# Altium schematic sheet AD.SchDoc
size A2; Organization: Protel International P/L; Address1: L3, 12a Rodborough Rd; Address2: Frenchs Forest; Address3: NSW; Address4: Australia 2086
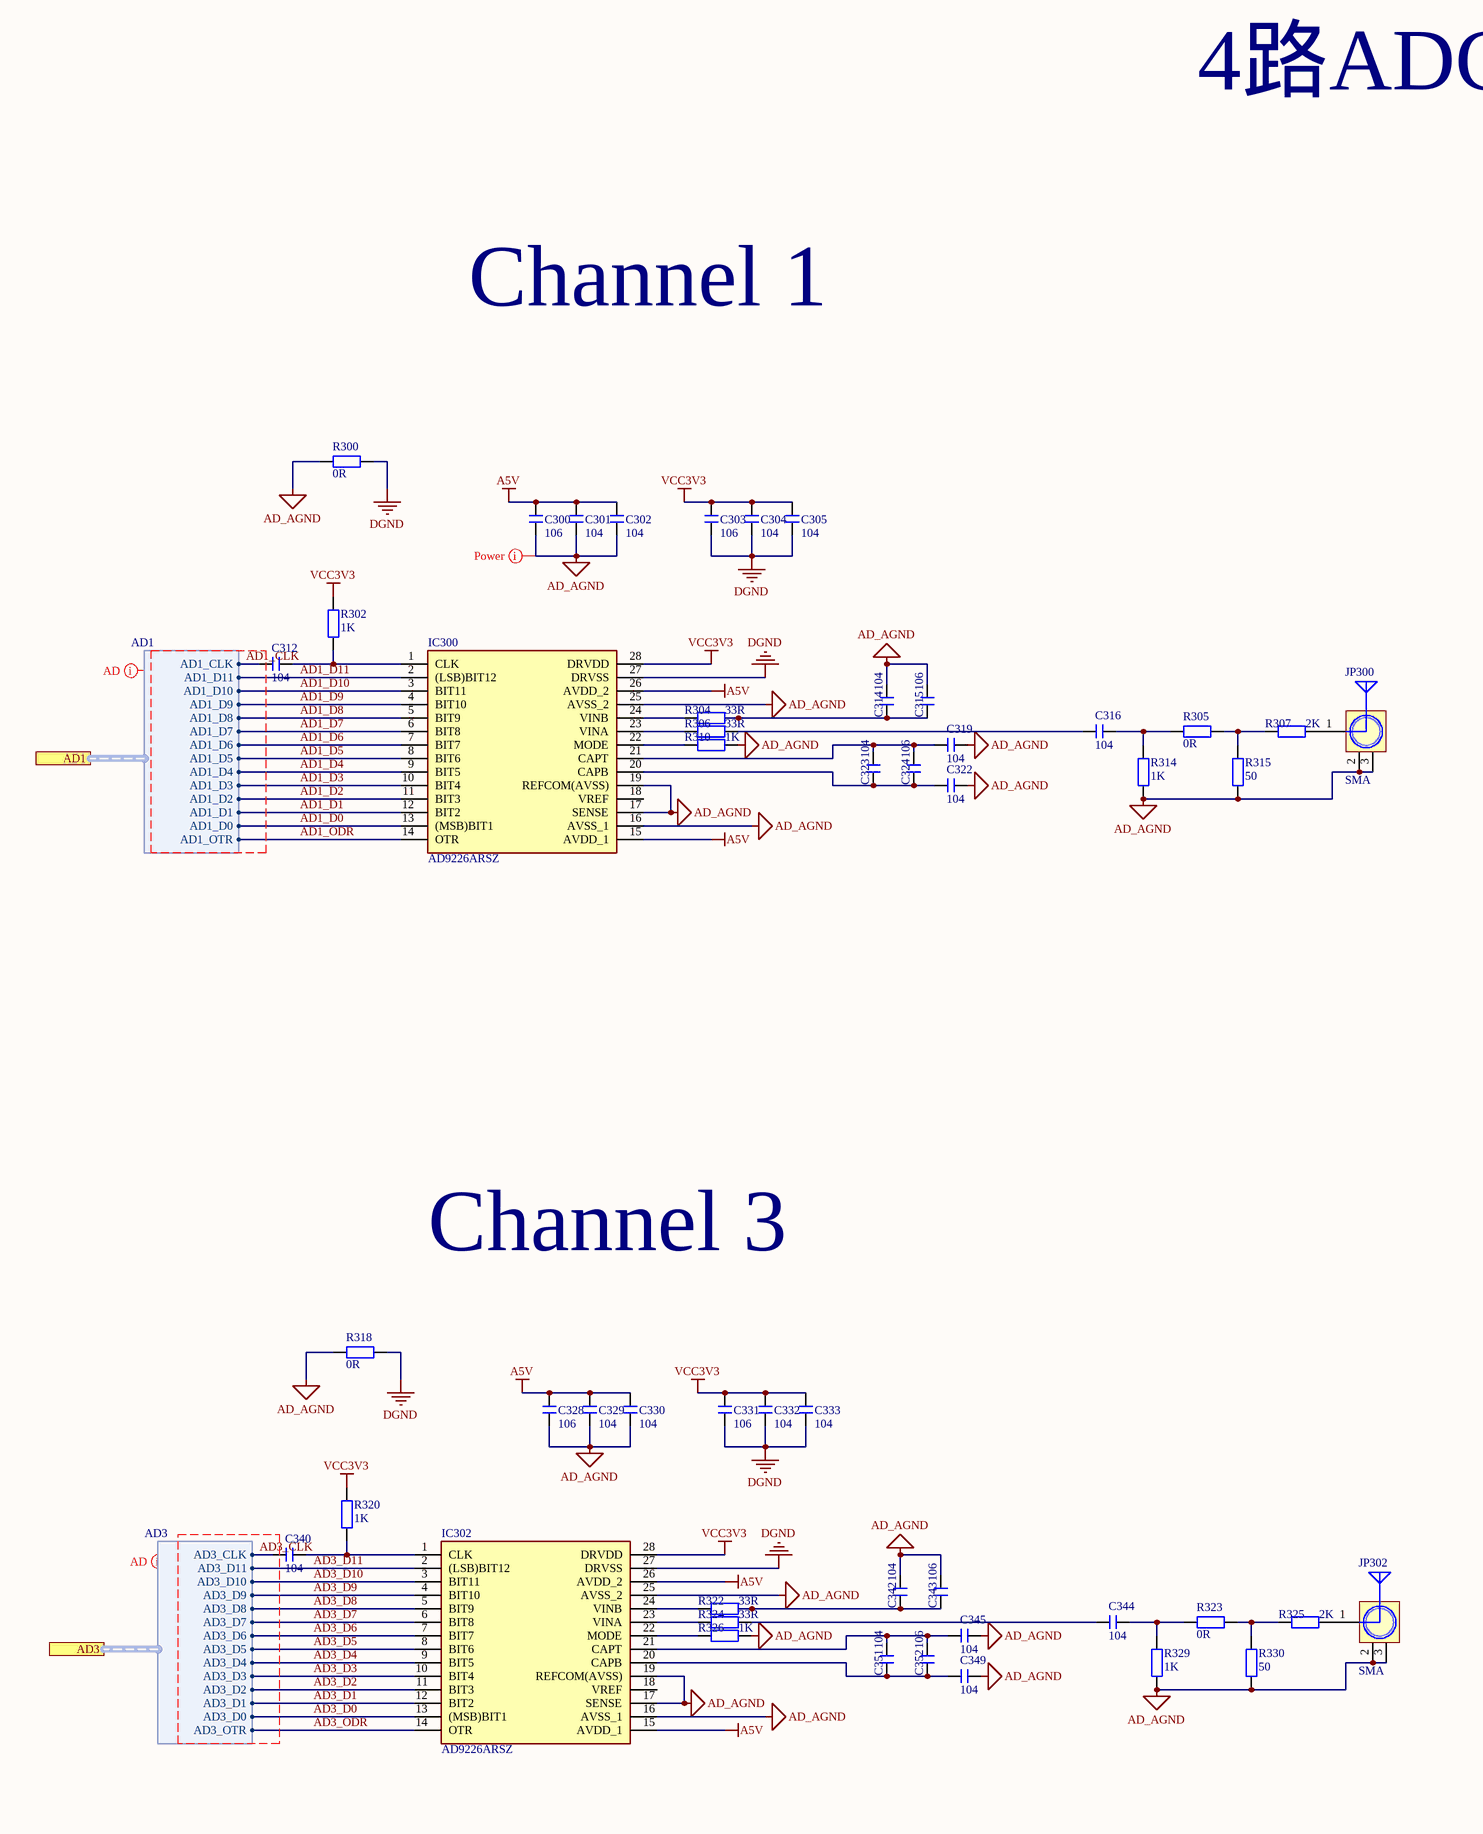
[diagram p0: AD.SchDoc, left]
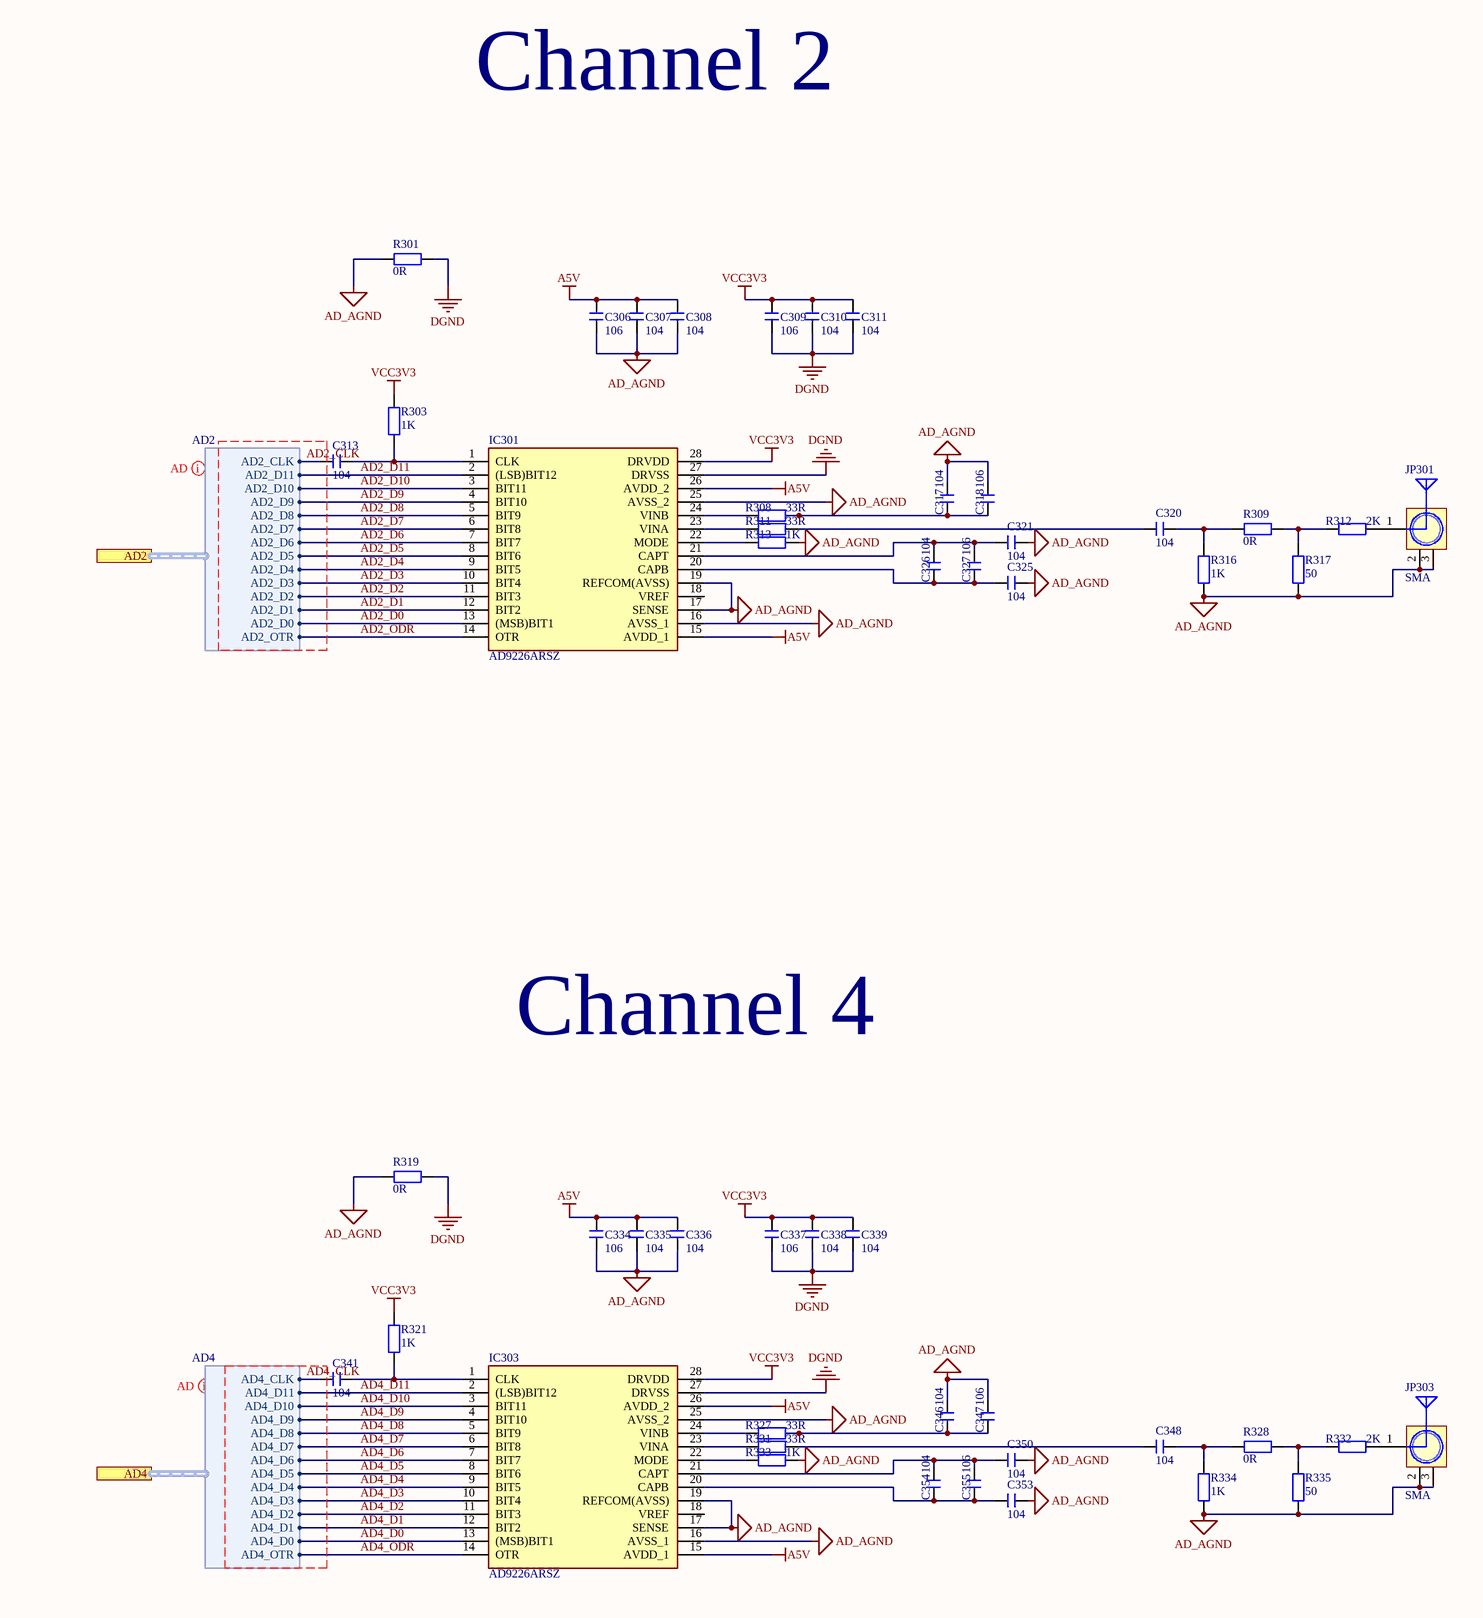
[diagram p1: AD.SchDoc, right]

## Parts
C300  106  [C 0402_M]
C301  104  [C 0402_M]
C302  104  [C 0402_M]
C303  106  [C 0402_M]
C304  104  [C 0402_M]
C305  104  [C 0402_M]
C306  106  [C 0402_M]
C307  104  [C 0402_M]
C308  104  [C 0402_M]
C309  106  [C 0402_M]
C310  104  [C 0402_M]
C311  104  [C 0402_M]
C312  104  [C 0402_M]
C313  104  [C 0402_M]
C314  104  [C 0402_M]
C315  106  [C 0402_M]
C316  104  [C 0402_M]
C317  104  [C 0402_M]
C318  106  [C 0402_M]
C319  104  [C 0402_M]
C320  104  [C 0402_M]
C321  104  [C 0402_M]
C322  104  [C 0402_M]
C323  104  [C 0402_M]
C324  106  [C 0402_M]
C325  104  [C 0402_M]
C326  104  [C 0402_M]
C327  106  [C 0402_M]
C328  106  [C 0402_M]
C329  104  [C 0402_M]
C330  104  [C 0402_M]
C331  106  [C 0402_M]
C332  104  [C 0402_M]
C333  104  [C 0402_M]
C334  106  [C 0402_M]
C335  104  [C 0402_M]
C336  104  [C 0402_M]
C337  106  [C 0402_M]
C338  104  [C 0402_M]
C339  104  [C 0402_M]
C340  104  [C 0402_M]
C341  104  [C 0402_M]
C342  104  [C 0402_M]
C343  106  [C 0402_M]
C344  104  [C 0402_M]
C345  104  [C 0402_M]
C346  104  [C 0402_M]
C347  106  [C 0402_M]
C348  104  [C 0402_M]
C349  104  [C 0402_M]
C350  104  [C 0402_M]
C351  104  [C 0402_M]
C352  106  [C 0402_M]
C353  104  [C 0402_M]
C354  104  [C 0402_M]
C355  106  [C 0402_M]
IC300  AD9226ARSZ  [SOP65P777X198-28N]
IC301  AD9226ARSZ  [SOP65P777X198-28N]
IC302  AD9226ARSZ  [SOP65P777X198-28N]
IC303  AD9226ARSZ  [SOP65P777X198-28N]
JP300  SMA  [SMA_FR]
JP301  SMA  [SMA_FR]
JP302  SMA  [SMA_FR]
JP303  SMA  [SMA_FR]
R300  0R  [R 0402_M]
R301  0R  [R 0402_M]
R302  1K  [R 0402_M]
R303  1K  [R 0402_M]
R304  33R  [R 0402_M]
R305  0R  [R 0402_M]
R306  33R  [R 0402_M]
R307  2K  [R 0402_M]
R308  33R  [R 0402_M]
R309  0R  [R 0402_M]
R310  1K  [R 0402_M]
R311  33R  [R 0402_M]
R312  2K  [R 0402_M]
R313  1K  [R 0402_M]
R314  1K  [R 0402_M]
R315  50  [R 0402_M]
R316  1K  [R 0402_M]
R317  50  [R 0402_M]
R318  0R  [R 0402_M]
R319  0R  [R 0402_M]
R320  1K  [R 0402_M]
R321  1K  [R 0402_M]
R322  33R  [R 0402_M]
R323  0R  [R 0402_M]
R324  33R  [R 0402_M]
R325  2K  [R 0402_M]
R326  1K  [R 0402_M]
R327  33R  [R 0402_M]
R328  0R  [R 0402_M]
R329  1K  [R 0402_M]
R330  50  [R 0402_M]
R331  33R  [R 0402_M]
R332  2K  [R 0402_M]
R333  1K  [R 0402_M]
R334  1K  [R 0402_M]
R335  50  [R 0402_M]

## Ports
AD1 (harness AD1), AD2 (harness AD2), AD3 (harness AD3), AD4 (harness AD4)

## Harnesses
AD1: AD1_CLK, AD1_D11, AD1_D10, AD1_D9, AD1_D8, AD1_D7, AD1_D6, AD1_D5, AD1_D4, AD1_D3, AD1_D2, AD1_D1, AD1_D0, AD1_OTR
AD2: AD2_CLK, AD2_D11, AD2_D10, AD2_D9, AD2_D8, AD2_D7, AD2_D6, AD2_D5, AD2_D4, AD2_D3, AD2_D2, AD2_D1, AD2_D0, AD2_OTR
AD3: AD3_CLK, AD3_D11, AD3_D10, AD3_D9, AD3_D8, AD3_D7, AD3_D6, AD3_D5, AD3_D4, AD3_D3, AD3_D2, AD3_D1, AD3_D0, AD3_OTR
AD4: AD4_CLK, AD4_D11, AD4_D10, AD4_D9, AD4_D8, AD4_D7, AD4_D6, AD4_D5, AD4_D4, AD4_D3, AD4_D2, AD4_D1, AD4_D0, AD4_OTR

## Nets
A5V: C300.1 C301.1 C302.1 C306.1 C307.1 C308.1 C328.1 C329.1 C330.1 C334.1 C335.1 C336.1 IC300.15(AVDD_1) IC300.26(AVDD_2) IC301.15(AVDD_1) IC301.26(AVDD_2) IC302.15(AVDD_1) IC302.26(AVDD_2) IC303.15(AVDD_1) IC303.26(AVDD_2)
AD_AGND: C300.2 C301.2 C302.2 C306.2 C307.2 C308.2 C314.2 C315.2 C317.2 C318.2 C319.1 C321.1 C322.1 C325.1 C328.2 C329.2 C330.2 C334.2 C335.2 C336.2 C342.2 C343.2 C345.1 C346.2 C347.2 C349.1 C350.1 C353.1 IC300.16(AVSS_1) IC300.17(SENSE) IC300.19(REFCOM(AVSS)) IC300.25(AVSS_2) IC301.16(AVSS_1) IC301.17(SENSE) IC301.19(REFCOM(AVSS)) IC301.25(AVSS_2) IC302.16(AVSS_1) IC302.17(SENSE) IC302.19(REFCOM(AVSS)) IC302.25(AVSS_2) IC303.16(AVSS_1) IC303.17(SENSE) IC303.19(REFCOM(AVSS)) IC303.25(AVSS_2) JP300.2(GND) JP300.3(GND) JP301.2(GND) JP301.3(GND) JP302.2(GND) JP302.3(GND) JP303.2(GND) JP303.3(GND) R300.1 R301.1 R310.2 R313.2 R314.1 R315.1 R316.1 R317.1 R318.1 R319.1 R326.2 R329.1 R330.1 R333.2 R334.1 R335.1
DGND: C303.2 C304.2 C305.2 C309.2 C310.2 C311.2 C331.2 C332.2 C333.2 C337.2 C338.2 C339.2 IC300.27(DRVSS) IC301.27(DRVSS) IC302.27(DRVSS) IC303.27(DRVSS) R300.2 R301.2 R318.2 R319.2
VCC3V3: C303.1 C304.1 C305.1 C309.1 C310.1 C311.1 C331.1 C332.1 C333.1 C337.1 C338.1 C339.1 IC300.28(DRVDD) IC301.28(DRVDD) IC302.28(DRVDD) IC303.28(DRVDD) R302.1 R303.1 R320.1 R321.1
AD1_CLK: C312.2 ; port AD1.AD1_CLK
AD1_D0: IC300.13((MSB)BIT1) ; port AD1.AD1_D0
AD1_D1: IC300.12(BIT2) ; port AD1.AD1_D1
AD1_D2: IC300.11(BIT3) ; port AD1.AD1_D2
AD1_D3: IC300.10(BIT4) ; port AD1.AD1_D3
AD1_D4: IC300.9(BIT5) ; port AD1.AD1_D4
AD1_D5: IC300.8(BIT6) ; port AD1.AD1_D5
AD1_D6: IC300.7(BIT7) ; port AD1.AD1_D6
AD1_D7: IC300.6(BIT8) ; port AD1.AD1_D7
AD1_D8: IC300.5(BIT9) ; port AD1.AD1_D8
AD1_D9: IC300.4(BIT10) ; port AD1.AD1_D9
AD1_D10: IC300.3(BIT11) ; port AD1.AD1_D10
AD1_D11: IC300.2((LSB)BIT12) ; port AD1.AD1_D11
AD1_ODR: IC300.14(OTR) ; port AD1.AD1_OTR
AD2_CLK: C313.2 ; port AD2.AD2_CLK
AD2_D0: IC301.13((MSB)BIT1) ; port AD2.AD2_D0
AD2_D1: IC301.12(BIT2) ; port AD2.AD2_D1
AD2_D2: IC301.11(BIT3) ; port AD2.AD2_D2
AD2_D3: IC301.10(BIT4) ; port AD2.AD2_D3
AD2_D4: IC301.9(BIT5) ; port AD2.AD2_D4
AD2_D5: IC301.8(BIT6) ; port AD2.AD2_D5
AD2_D6: IC301.7(BIT7) ; port AD2.AD2_D6
AD2_D7: IC301.6(BIT8) ; port AD2.AD2_D7
AD2_D8: IC301.5(BIT9) ; port AD2.AD2_D8
AD2_D9: IC301.4(BIT10) ; port AD2.AD2_D9
AD2_D10: IC301.3(BIT11) ; port AD2.AD2_D10
AD2_D11: IC301.2((LSB)BIT12) ; port AD2.AD2_D11
AD2_ODR: IC301.14(OTR) ; port AD2.AD2_OTR
AD3_CLK: C340.2 ; port AD3.AD3_CLK
AD3_D0: IC302.13((MSB)BIT1) ; port AD3.AD3_D0
AD3_D1: IC302.12(BIT2) ; port AD3.AD3_D1
AD3_D2: IC302.11(BIT3) ; port AD3.AD3_D2
AD3_D3: IC302.10(BIT4) ; port AD3.AD3_D3
AD3_D4: IC302.9(BIT5) ; port AD3.AD3_D4
AD3_D5: IC302.8(BIT6) ; port AD3.AD3_D5
AD3_D6: IC302.7(BIT7) ; port AD3.AD3_D6
AD3_D7: IC302.6(BIT8) ; port AD3.AD3_D7
AD3_D8: IC302.5(BIT9) ; port AD3.AD3_D8
AD3_D9: IC302.4(BIT10) ; port AD3.AD3_D9
AD3_D10: IC302.3(BIT11) ; port AD3.AD3_D10
AD3_D11: IC302.2((LSB)BIT12) ; port AD3.AD3_D11
AD3_ODR: IC302.14(OTR) ; port AD3.AD3_OTR
AD4_CLK: C341.2 ; port AD4.AD4_CLK
AD4_D0: IC303.13((MSB)BIT1) ; port AD4.AD4_D0
AD4_D1: IC303.12(BIT2) ; port AD4.AD4_D1
AD4_D2: IC303.11(BIT3) ; port AD4.AD4_D2
AD4_D3: IC303.10(BIT4) ; port AD4.AD4_D3
AD4_D4: IC303.9(BIT5) ; port AD4.AD4_D4
AD4_D5: IC303.8(BIT6) ; port AD4.AD4_D5
AD4_D6: IC303.7(BIT7) ; port AD4.AD4_D6
AD4_D7: IC303.6(BIT8) ; port AD4.AD4_D7
AD4_D8: IC303.5(BIT9) ; port AD4.AD4_D8
AD4_D9: IC303.4(BIT10) ; port AD4.AD4_D9
AD4_D10: IC303.3(BIT11) ; port AD4.AD4_D10
AD4_D11: IC303.2((LSB)BIT12) ; port AD4.AD4_D11
AD4_ODR: IC303.14(OTR) ; port AD4.AD4_OTR
NetC312_1: C312.1 IC300.1(CLK) R302.2
NetC313_1: C313.1 IC301.1(CLK) R303.2
NetC314_1: C314.1 C315.1 R304.2
NetC316_1: C316.1 R305.2 R314.2
NetC316_2: C316.2 R306.2
NetC317_1: C317.1 C318.1 R308.2
NetC319_2: C319.2 C323.2 C324.2 IC300.21(CAPT)
NetC320_1: C320.1 R309.2 R316.2
NetC320_2: C320.2 R311.2
NetC321_2: C321.2 C326.2 C327.2 IC301.21(CAPT)
NetC322_2: C322.2 C323.1 C324.1 IC300.20(CAPB)
NetC325_2: C325.2 C326.1 C327.1 IC301.20(CAPB)
NetC340_1: C340.1 IC302.1(CLK) R320.2
NetC341_1: C341.1 IC303.1(CLK) R321.2
NetC342_1: C342.1 C343.1 R322.2
NetC344_1: C344.1 R323.2 R329.2
NetC344_2: C344.2 R324.2
NetC345_2: C345.2 C351.2 C352.2 IC302.21(CAPT)
NetC346_1: C346.1 C347.1 R327.2
NetC348_1: C348.1 R328.2 R334.2
NetC348_2: C348.2 R331.2
NetC349_2: C349.2 C351.1 C352.1 IC302.20(CAPB)
NetC350_2: C350.2 C354.2 C355.2 IC303.21(CAPT)
NetC353_2: C353.2 C354.1 C355.1 IC303.20(CAPB)
NetIC300_22: IC300.22(MODE) R310.1
NetIC300_23: IC300.23(VINA) R306.1
NetIC300_24: IC300.24(VINB) R304.1
NetIC301_22: IC301.22(MODE) R313.1
NetIC301_23: IC301.23(VINA) R311.1
NetIC301_24: IC301.24(VINB) R308.1
NetIC302_22: IC302.22(MODE) R326.1
NetIC302_23: IC302.23(VINA) R324.1
NetIC302_24: IC302.24(VINB) R322.1
NetIC303_22: IC303.22(MODE) R333.1
NetIC303_23: IC303.23(VINA) R331.1
NetIC303_24: IC303.24(VINB) R327.1
NetJP300_1: JP300.1(ANT) R307.2
NetJP301_1: JP301.1(ANT) R312.2
NetJP302_1: JP302.1(ANT) R325.2
NetJP303_1: JP303.1(ANT) R332.2
NetR305_1: R305.1 R307.1 R315.2
NetR309_1: R309.1 R312.1 R317.2
NetR323_1: R323.1 R325.1 R330.2
NetR328_1: R328.1 R332.1 R335.2

Not connected (* = marked no-connect by the designer): IC300 18(VREF); IC301 18(VREF); IC302 18(VREF); IC303 18(VREF)

## Layout directives
net class Power: AD_AGND
net class AD1; rule Matched Net Lengths [Tolerance = 100mil]: AD1_CLK
net class AD2; rule Matched Net Lengths [Tolerance = 50mil]: AD2_CLK
net class AD3; rule Matched Net Lengths [Tolerance = 100mil]: AD3_CLK
net class AD4; rule Matched Net Lengths [Tolerance = 100mil]: AD4_CLK

## Notes on the sheet
- 4路ADC 48M
- Channel 1
- Channel 2
- Channel 3
- Channel 4
- Title
- Size:
- Date:
- File:
- A2
- Number:
- Time:
- Revision:
- Sheet
- of

## Library data of the parts
C300-C355 = C: 无极性贴片电容; 版权归属: 源创客; BOM名称: 无极性贴片电容; 学习资源: www.ooocke.com
IC300-IC303 = AD9226ARSZ: Integrated Circuit; Manufacturer_Name: Analog Devices; Datasheet Link: http://docs-emea.rs-online.com/webdocs/0501/0900766b80501af6.pdf; Height: 1.98mm; Manufacturer_Part_Number: AD9226ARSZ; Mouser Part Number: 584-AD9226ARSZ; Mouser Price/Stock: https://www.mouser.com/Search/Refine.aspx?Keyword=584-AD9226ARSZ; RS Part Number: 4973407P; RS Price/Stock: http://uk.rs-online.com/web/p/products/4973407P
JP300-JP303 = SMA: SMA-2.4G射频天线接口; 版权归属: 源创客; BOM名称: SMA-2.4G射频天线接口; 学习资源: www.ooocke.com
R300-R335 = R: 贴片电阻; 版权归属: 源创客; BOM名称: 贴片电阻; 学习资源: www.ooocke.com